# Altium schematic sheet PowerConversion.SchDoc
size A4; SheetNumber: 4; SheetTotal: 5; SPICEModelCacheAJXRZOQB: <root> / <DocumentId>AJXRZOQB</DocumentId> / <CacheFrame Number="0"> / <Model Name="cap" Kind="MDL"> / <Text>*Default semiconductor capacitor / .MODEL CAP C()</Text> / </Model> / </CacheFrame> / </root>
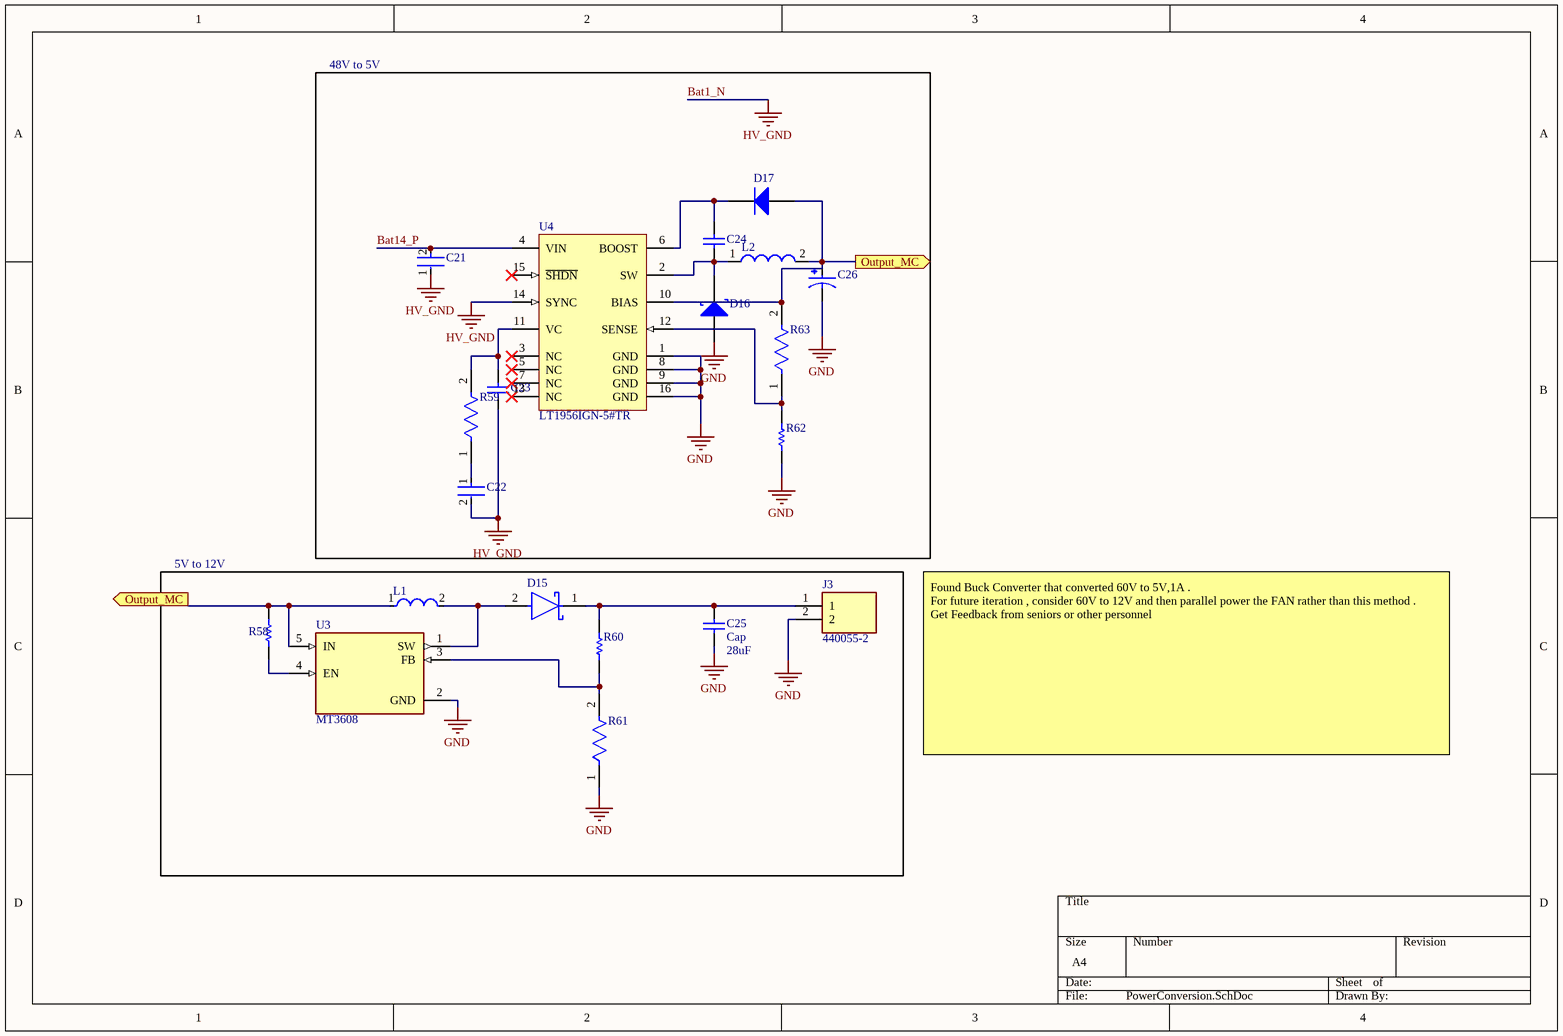
[diagram p0: PowerConversion.SchDoc]

## Parts
C21  18121C225KAZ2A  [FP-1812-L_4_5_0_3-W_3_2_0-IPC_C]  (value not drawn)
C22  CC0603KRX7R9BB223  [FP-CC0603-DA-MFG]  (value not drawn)
C23  C0805C221K5RACTU  [CAPC2013X88X50LL20T25]  (value not drawn)
C24  04025A331JAT2A  [CAPC1005X56X25NL10T15]  (value not drawn)
C25  Cap  value 28uF  [RAD-0.3]
C26  EEE1AA101WR  [CAP_EEE1AA101WR]  (value not drawn)
D15  SS34-E3/57T  [FP-95402-MFG]  (value not drawn)
D16  VS-10MQ060NTRPBF  [VISH-DO-214AC_V]  (value not drawn)
D17  1N4148W-7-F  [DIOD-SOD123-2_V]  (value not drawn)
J3  440055-2  [TE_440055-2]
L1  IHLP2525CZER220M11  [FP-IHLP-2525CZ-FP_2_413x3-MFG]  (value not drawn)
L2  7447471473  [WE-TIS 1111]  (value not drawn)
R58  CRCW040210K0FKEDHP  [RESC1005X40X25ML05T10]  (value not drawn)
R59  AC0402FR-072K2L  [FP-AC0402-IPC_A]  (value not drawn)
R60  CRCW040262K0FKED  [RESC1005X40X25LL05T05]  (value not drawn)
R61  AC0402FR-073K3L  [FP-AC0402-IPC_B]  (value not drawn)
R62  ERA6AEB4991V  [RESC2013X60X40ML20T25]  (value not drawn)
R63  RG2012N-1542-D-T5  [FP-RG2012-IPC_C]  (value not drawn)
U3  MT3608  [SOT95P280X145-6N]
U4  LT1956IGN-5#TR  [LT-GN-16_M]

## Blocks framed on the sheet
48V to 5V: C21-C24 C26 D16 D17 L2 R59 R62 R63 U4
5V to 12V: C25 D15 J3 L1 R58 R60 R61 U3

## Ports
Output_MC (out)

## Nets
Bat1_N: C21.1 C22.2 C23.1 U4.14(SYNC)  [also labelled HV_GND]
GND: C25.1 C26.2 D16.1(A) J3.2 R61.1 R62.1 U3.2(GND) U4.1(GND) U4.8(GND) U4.9(GND) U4.16(GND)
Bat14_P: C21.2 U4.4(VIN)
Output_MC: C26.1 D17.1(A) L1.1 L2.2 R58.2 R63.2 U3.5(IN) U4.10(BIAS) ; port Output_MC
NetC22_1: C22.1 R59.1
NetC23_2: C23.2 R59.2 U4.11(VC)
NetC24_1: C24.1 D16.2(K) L2.1 U4.2(SW)
NetC24_2: C24.2 D17.2(K) U4.6(BOOST)
NetC25_2: C25.2 D15.1(C) J3.1 R60.2
NetD15_2: D15.2(A) L1.2 U3.1(SW)
NetR58_1: R58.1 U3.4(EN)
NetR60_1: R60.1 R61.2 U3.3(FB)
NetR62_2: R62.2 R63.1 U4.12(SENSE)

Not connected (* = marked no-connect by the designer): U4 3(NC)* 5(NC)* 7(NC)* 13(NC)* 15(~{SHDN})*

## Notes on the sheet
- Found Buck Converter that converted 60V to 5V,1A .
  For future iteration , consider 60V to 12V and then parallel power the FAN rather than this method .
  Get Feedback from seniors or other personnel

## Library data of the parts
C21 = CMP-2000-05505-2: General Purpose Ceramic Capacitor, 1812, 2.2uF, 10%, X7R, 15%, 100V; Dissipation Factor: 2.5%; Case/Package: 1812; Voltage Rating: 100V; Min Operating Temperature: -55°C; RoHS Compliant: Yes; Radiation Hardening: No; Thickness: 0.11inch; Termination: SMD/SMT; Width: 0.126inch; Height: 2.54mm; Mount: Surface Mount; Capacitance: 2.2uF; Tolerance: 10%; Max Operating Temperature: 125°C; Features: Soft Termination; REACH SVHC: No SVHC; Dielectric: X7R; Case Code (Imperial): 1812; Number of Pins: 2; Case Code (Metric): 4532; Packaging: Tape and Reel; Length: 4.5mm; Voltage: 100V; Depth: 3.2mm; Package Quantity: 1; Voltage Rating (DC): 100V; Lead Free: Lead Free
C22 = CMP-2100-03602-3: CAP CER 0.022UF 50V X7R 0603; Dielectric Material: Ceramic; Insulation Resistance: 100GR; Tolerance: 10%; Capacitance: 22nF; Thickness: 0.035inch; Case/Package: 0603; Packaging: Tape and Reel; Voltage Rating (DC): 50V; Length: 1.6mm; Depth: 0.8mm; Dielectric: X7R; Resistor Type: Ceramic; Min Operating Temperature: -55°C; Number of Pins: 2; Series: CC; Mount: Surface Mount; Max Operating Temperature: 125°C; Case Code (Imperial): 0603; Width: 0.031inch; Halogen Free: Halogen Free; Lead Free: Lead Free; Voltage: 50V; RoHS Compliant: Yes; Package Quantity: 1; Height: 0.8mm; REACH SVHC: No SVHC; Voltage Rating: 50V; Case Code (Metric): 1608; Termination: SMD/SMT; Radiation Hardening: No
C23 = CMP-2007-00321-1: Manufacturer: Kemet; Part Number: C0805C221K5RACTU
C24 = CMP-2008-02640-1: Manufacturer: AVX Interconnect / Elco; Part Number: 04025A331JAT2A
C25 = Cap: Capacitor; Published: 8-Jun-2000; LatestRevisionDate: 17-Jul-2002; LatestRevisionNote: Re-released for DXP Platform.; PackageReference: RAD-0.3; Publisher: Altium Limited; PackageDescription: Radial Cap, Thru-Hole; 2 Leads; 0.3 in Pin Spacing
C26 = EEE1AA101WR: MF: {'manufacturer': u'Panasonic'}; Package: None; Price: None; Value: *; MP: EEE1AA101WR; Availability: Unavailable
D15 = CMP-02539-000012-1: DIODE SCHOTTKY 40V 3A DO214AB; Manufacturer: Vishay; Max Junction Temp: +150°C; Peak Reverse Current: 0.5mA; Max Surge Forward Current: 100A; Standoff Height: 0mm; ComponentLink2Description: Datasheet; Device Class L3: Schottky Diodes; Height: 2.62mm; Max Repetitive Reverse Voltage: 40V; Lead Free: Yes; Package: 95402; Temperature Range High: +150°C; ComponentLink2URL: http://www.vishay.com/docs/88751/ss32.pdf; Temperature: -55°C to +150°C; Footprint Url: http://www.vishay.com/docs/95402/smc.pdf; Automotive: No; Forward Current: 3A; Category: Diode; Manufacturer Part Number: SS34-E3/57T; RoHS: TRUE; Device Class L2: Diodes; Mouser Description: Schottky Diodes & Rectifiers 3.0 Amp 40 Volt; Octopart: https://octopart.com/ss34-e3%2F57t-vishay-39552907; Temperature Range Low: -55°C; Device Class L1: Discrete Semiconductors; Digikey Description: DIODE SCHOTTKY 40V 3A DO214AB
D16 = CMP-2000-07404-1: High Performance Schottky Rectifier, 60 V, 1 A, -55 to 150 degC, 2-Pin DO-214AC (SMA), RoHS, Tape and Reel; Manufacturer: Vishay; Current - Reverse Leakage @ Vr: 500µA@60V; Current - Average Rectified (Io): 2.1A; Speed: FastRecovery= / 200mA(Io); Voltage - Forward (Vf) (Max) @ If: 710mV@1.5A; Thermal Resistance: 80°C/WJa; Voltage - DC Reverse (Vr) (Max): 60V; Catalog Drawings: SMASeriesTop / SMASeriesSide; Other Names: 10MQ060NPBFTR / 10MQ060NTRPBF / VS-10MQ060NPBFTR / VS-10MQ060NPBFTR-ND / VS10MQ060NPBFTR-ND / VS10MQ060NTRPBF; Dynamic Catalog: SchottkyDiode; Mounting Type: SurfaceMount; Supplier Device Package: DO-214AC(SMA); Package / Case: DO-214AC,SMA; Mounting Technology: SurfaceMount; Datasheet URL: http://www.vishay.com/docs/94118/vs-10mq060npbf.pdf; Category: DiscreteSemiconductorProducts; Family: Diodes,Rectifiers-Single; Datasheet Version: 02/2015; Package Description: 2-Pin Surface Mount Device, Body 4.245 x 2.665 mm; Quantity Available: Tape&Reel(TR)AlternatePackaging; Junction Operating Temp: -55°C~150°C; Manufacturer URL: http://www.vishay.com/; Diode Type: Schottky; Package Reference: DO-214AC (SMA); Packaging: Tape&Reel(TR); Minimum Quantity: Schottky; Operating Temperature - Junction: -55°C~150°C; Standard Package: 7,500
D17 = CMP-2000-04932-2: Fast Switching Diode, 100 V, 0.15 A, -65 to 150 degC, 2-Pin?SOD123, RoHS, Tape and Reel; Recovery Time: 4ns; Brand: DiodesIncorporated; Unit Weight: 0.000353oz; Max Surge Current: 2A; Peak Reverse Voltage: 100V; Ir - Reverse Current: 1uA; Vf - Forward Voltage: 1.25V; Configuration: Single; If - Forward Current: 0.15A; Product Category: Diodes-GeneralPurpose,Power,Switching; Operating Temperature Range: -65Cto+150C; Packaging: Reel; Manufacturer URL: http://www.diodes.com/; Maximum Operating Temperature: +150C; Height: 1.25mm; Minimum Operating Temperature: -65C; Product: SwitchingDiodes; Package URL: http://www.diodes.com/datasheets/ds18004.pdf; Type: SwitchingDiode; Package Reference: SOD123-2; Width: 1.7mm; Datasheet URL: http://www.farnell.com/datasheets/1915529.pdf; Datasheet Version: Rev. 24-2, 10/2013; Series: 1N4148; Factory Pack Quantity: 3000; Length: 2.85mm; RoHS: True; Manufacturer: DiodesIncorporated; Mounting Style: SMD/SMT; Package / Case: SOD-123
J3 = 440055-2: MF: {'manufacturer': u'TE Connectivity'}; Package: None; Price: None; Value: *; MP: 440055-2; Availability: Unavailable
L1 = CMP-2000-06442-2: Commercial Inductors, Low DCR Series 22uH 2.9A 135mΩ 20%; Self Resonant Frequency: 1MHz; Shielding: Shielded; Core Material: Ferrite; DC Resistance (DCR): 135mR; Test Frequency: 100kHz; Saturation Current: 2.5A; Case/Package: 2525; Inductance Tolerance: 20%; Max DC Current: 2.9A; Inductance: 22uH; Termination: SMD/SMT; Case Code (Imperial): 2525; Mount: Surface Mount; Military Standard: Not; Min Operating Temperature: -55°C; RMS Current (Irms): 2.9A; Package Quantity: 2000; Max Operating Temperature: 125°C; Length: 7.24mm; Depth: 6.72mm; Packaging: Tape and Reel; Height: 3mm; Width: 0.255inch; Lead Free: Lead Free; Tolerance: 20%; Contact Plating: Tin; Current Rating: 2.9A; Number of Pins: 2; Case Code (Metric): 6363; Radiation Hardening: No; Height - Seated (Max): 0.118inch
L2 = CMP-1406-00013-1: Shielded Radial Leaded Wire Wound Inductor WE-TIS, L=47000 µH; Manufacturer: Wuerth Elektronik; Inductance: 47000 ÂµH; ComponentLink2URL: http://www.we-online.de/katalog/media/pdf/7447471473.pdf; ComponentLink2Description: Datasheet; ComponentLink1Description: Manufacturer URL; ComponentLink1URL: http://www.we-online.com; PackageReference: WE-TIS 1111; PartNumber: 7447471473
R58 = CMP-2002-03043-1: Manufacturer: Vishay Dale; Part Number: CRCW040210K0FKEDHP
R59 = CMP-2002-01808-3: RES 2.2kΩ ±1% 0.063W 0402; Temperature Coefficient: 100ppm/°C; Power Rating: 62.5mW; Resistance: 2.2kR; Voltage Rating: 50V; Max Power Dissipation: 63mW; Series: AC; Resistor Type: Thick Film; Case Code (Imperial): 0402; Case Code (Metric): 1005; Features: Moisture Resistant; Termination: SMD/SMT; Height: 0.015inch; Lead Free: Lead Free; Min Operating Temperature: -55°C; RoHS Compliant: Yes; Packaging: Tape and Reel; Tolerance: 1%; Case/Package: 0402; Width: 0.5mm; Length: 0.039inch; Number of Terminations: 2; Weight: 2.3E-05oz; Size Code: 0402; Max Operating Temperature: 155°C
R60 = CMP-2002-00149-1: Manufacturer: Vishay Dale; Part Number: CRCW040262K0FKED
R61 = CMP-2002-01817-3: RES 3.3kΩ ±1% 0.063W 0402; Resistance: 3.3kR; Max Power Dissipation: 63mW; Voltage Rating: 50V; Temperature Coefficient: 100ppm/°C; Power Rating: 62.5mW; Lead Free: Lead Free; Case/Package: 0402; Packaging: Tape and Reel; Min Operating Temperature: -55°C; Tolerance: 1%; RoHS Compliant: Yes; Features: Moisture Resistant; Series: AC; Number of Terminations: 2; Size Code: 0402; Length: 0.039inch; Case Code (Imperial): 0402; Resistor Type: Thick Film; Case Code (Metric): 1005; Termination: SMD/SMT; Width: 0.5mm; Height: 0.015inch; Max Operating Temperature: 155°C
R62 = CMP-2001-00838-1: Manufacturer: Panasonic; Part Number: ERA6AEB4991V
R63 = CMP-28537-000974-1: Automotive Metal Thin Film Chip Resistor, 0805, 15.4kΩ, 0.5%, 10ppm/°C, 0.125W, 150V; Voltage Rating: 100V; Power Rating: 100mW; Resistance: 15.4kR; Max Power Dissipation: 125mW; Case Code (Imperial): 0805; Termination: SMD/SMT; Lead Free: Lead Free; Max Operating Temperature: 155°C; Temperature Coefficient: 10ppm/°C; Features: Automotive AEC-Q200; Case/Package: 0805; Packaging: Tape and Reel; Voltage Rating (DC): 150V; Tolerance: 0.5%; Min Operating Temperature: -55°C; Number of Terminations: 2; Series: RG; Case Code (Metric): 2012; RoHS Compliant: Yes
U3 = MT3608: High Efficiency 1.2MHz 2A Step Up Converter; MF: {'manufacturer': u'Aerosemi Technology Co., Ltd'}; Package: None; Price: None; Value: *; MP: MT3608; Availability: Unavailable
U4 = CMP-0491-00804-1: High Voltage, 1.5 A, 500 kHz Step-Down Switching Regulator, 16-pin SOP (GN-16), -40 to 125 degC, Tape and Reel; Manufacturer: Linear Technology; Frequency Sync Range: 580kHz - 700kHz; Number of Outputs: 1; Packing: Tape and Reel; ComponentLink2URL: http://cds.linear.com/docs/en/datasheet/1956f.pdf; Mounting Technology: Surface Mount; PackageReference: GN-16; PackageDescription: 16-Pin Plastic SSOP, Body 4.9 x 3.9 mm, Pitch 0.635 mm; ComponentLink3Description: Package Specification; RoHS: FALSE; PartNumber: LT1956IGN-5#TR; ComponentLink1Description: Manufacturer URL; ComponentLink1URL: http://www.linear.com/; ComponentLink2Description: Datasheet; PackageVersion: Rev. B, 03/2012; ComponentLink3URL: http://cds.linear.com/docs/en/packaging/05081641_B_GN16.pdf